# Altium schematic sheet FPGA_Power.SchDoc: =ProjectName
size 420 x 297 mm; Author: T.P.; CompanyName: WUT; DrawnBy: T.P.; Organization: WUT ISE; Address1: Warsaw Univeristy of Technology; Address2: Nowowiejska 15/19; DocumentNumber: 11; Revision: 0.9; SheetNumber: 11; SheetTotal: 36; EDA_Number: ARTIQ; Projet: ARTIQ/SINARA; ModifiedBy: -; CreateDate: XX/XX/XXXX; CheckedDate: -; Title2: FPGA_Power.SchDoc; DivGrp: ISE; Designer: G.K. and T.P.; ModifiedDate: -; ProjectName: ADC/DAC MEZZANINE
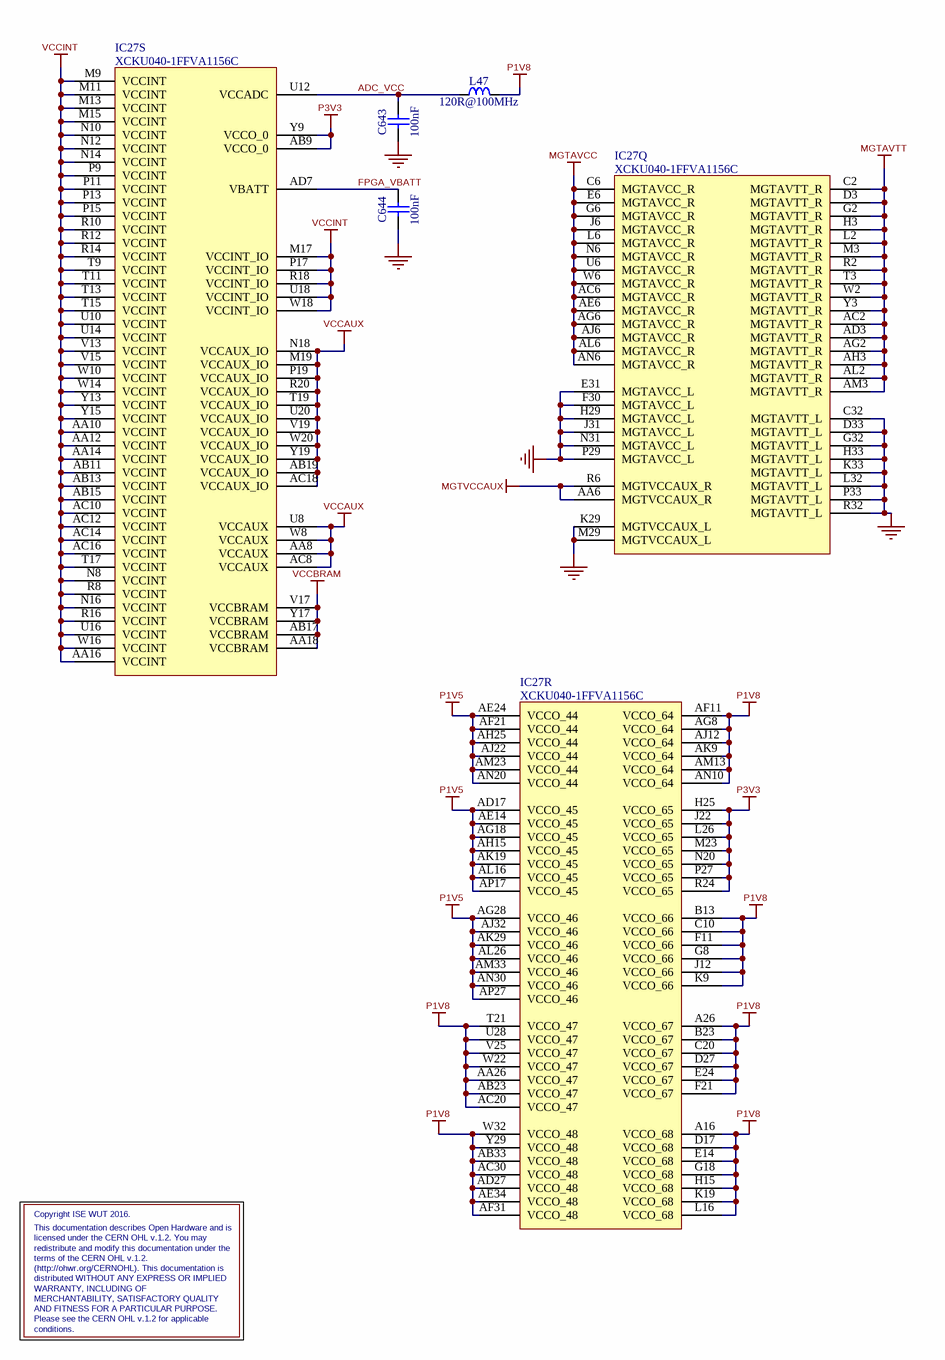
[diagram p0: FPGA_Power.SchDoc]

## Parts
C643  100nF  [CAPC0603X33N]
C644  100nF  [CAPC0603X33N]
IC27  XCKU040-1FFVA1156C  [BGA1156C100P34X34_3500X3500X350]  (parts Q,R,S of 22)
L47  120R@100MHz  [INDC1005X55N]

## Nets
GND: C643.1 C644.1 IC27.C32(MGTAVTT_L) IC27.D33(MGTAVTT_L) IC27.E31(MGTAVCC_L) IC27.F30(MGTAVCC_L) IC27.G32(MGTAVTT_L) IC27.H29(MGTAVCC_L) IC27.H33(MGTAVTT_L) IC27.J31(MGTAVCC_L) IC27.K29(MGTVCCAUX_L) IC27.K33(MGTAVTT_L) IC27.L32(MGTAVTT_L) IC27.M29(MGTVCCAUX_L) IC27.N31(MGTAVCC_L) IC27.P29(MGTAVCC_L) IC27.P33(MGTAVTT_L) IC27.R32(MGTAVTT_L)
MGTAVCC: IC27.AC6(MGTAVCC_R) IC27.AE6(MGTAVCC_R) IC27.AG6(MGTAVCC_R) IC27.AJ6(MGTAVCC_R) IC27.AL6(MGTAVCC_R) IC27.AN6(MGTAVCC_R) IC27.C6(MGTAVCC_R) IC27.E6(MGTAVCC_R) IC27.G6(MGTAVCC_R) IC27.J6(MGTAVCC_R) IC27.L6(MGTAVCC_R) IC27.N6(MGTAVCC_R) IC27.U6(MGTAVCC_R) IC27.W6(MGTAVCC_R)
MGTAVTT: IC27.AC2(MGTAVTT_R) IC27.AD3(MGTAVTT_R) IC27.AG2(MGTAVTT_R) IC27.AH3(MGTAVTT_R) IC27.AL2(MGTAVTT_R) IC27.AM3(MGTAVTT_R) IC27.C2(MGTAVTT_R) IC27.D3(MGTAVTT_R) IC27.G2(MGTAVTT_R) IC27.H3(MGTAVTT_R) IC27.L2(MGTAVTT_R) IC27.M3(MGTAVTT_R) IC27.R2(MGTAVTT_R) IC27.T3(MGTAVTT_R) IC27.W2(MGTAVTT_R) IC27.Y3(MGTAVTT_R)
MGTVCCAUX: IC27.AA6(MGTVCCAUX_R) IC27.R6(MGTVCCAUX_R)
P1V5: IC27.AD17(VCCO_45) IC27.AE14(VCCO_45) IC27.AE24(VCCO_44) IC27.AF21(VCCO_44) IC27.AG18(VCCO_45) IC27.AG28(VCCO_46) IC27.AH15(VCCO_45) IC27.AH25(VCCO_44) IC27.AJ22(VCCO_44) IC27.AJ32(VCCO_46) IC27.AK19(VCCO_45) IC27.AK29(VCCO_46) IC27.AL16(VCCO_45) IC27.AL26(VCCO_46) IC27.AM23(VCCO_44) IC27.AM33(VCCO_46) IC27.AN20(VCCO_44) IC27.AN30(VCCO_46) IC27.AP17(VCCO_45) IC27.AP27(VCCO_46)
P1V8: IC27.A16(VCCO_68) IC27.A26(VCCO_67) IC27.AA26(VCCO_47) IC27.AB23(VCCO_47) IC27.AB33(VCCO_48) IC27.AC20(VCCO_47) IC27.AC30(VCCO_48) IC27.AD27(VCCO_48) IC27.AE34(VCCO_48) IC27.AF11(VCCO_64) IC27.AF31(VCCO_48) IC27.AG8(VCCO_64) IC27.AJ12(VCCO_64) IC27.AK9(VCCO_64) IC27.AM13(VCCO_64) IC27.AN10(VCCO_64) IC27.B13(VCCO_66) IC27.B23(VCCO_67) IC27.C10(VCCO_66) IC27.C20(VCCO_67) IC27.D17(VCCO_68) IC27.D27(VCCO_67) IC27.E14(VCCO_68) IC27.E24(VCCO_67) IC27.F11(VCCO_66) IC27.F21(VCCO_67) IC27.G8(VCCO_66) IC27.G18(VCCO_68) IC27.H15(VCCO_68) IC27.J12(VCCO_66) IC27.K9(VCCO_66) IC27.K19(VCCO_68) IC27.L16(VCCO_68) IC27.T21(VCCO_47) IC27.U28(VCCO_47) IC27.V25(VCCO_47) IC27.W22(VCCO_47) IC27.W32(VCCO_48) IC27.Y29(VCCO_48) L47.2
P3V3: IC27.AB9(VCCO_0) IC27.H25(VCCO_65) IC27.J22(VCCO_65) IC27.L26(VCCO_65) IC27.M23(VCCO_65) IC27.N20(VCCO_65) IC27.P27(VCCO_65) IC27.R24(VCCO_65) IC27.Y9(VCCO_0)
VCCAUX: IC27.AA8(VCCAUX) IC27.AB19(VCCAUX_IO) IC27.AC8(VCCAUX) IC27.AC18(VCCAUX_IO) IC27.M19(VCCAUX_IO) IC27.N18(VCCAUX_IO) IC27.P19(VCCAUX_IO) IC27.R20(VCCAUX_IO) IC27.T19(VCCAUX_IO) IC27.U8(VCCAUX) IC27.U20(VCCAUX_IO) IC27.V19(VCCAUX_IO) IC27.W8(VCCAUX) IC27.W20(VCCAUX_IO) IC27.Y19(VCCAUX_IO)
VCCBRAM: IC27.AA18(VCCBRAM) IC27.AB17(VCCBRAM) IC27.V17(VCCBRAM) IC27.Y17(VCCBRAM)
VCCINT: IC27.AA10(VCCINT) IC27.AA12(VCCINT) IC27.AA14(VCCINT) IC27.AA16(VCCINT) IC27.AB11(VCCINT) IC27.AB13(VCCINT) IC27.AB15(VCCINT) IC27.AC10(VCCINT) IC27.AC12(VCCINT) IC27.AC14(VCCINT) IC27.AC16(VCCINT) IC27.M9(VCCINT) IC27.M11(VCCINT) IC27.M13(VCCINT) IC27.M15(VCCINT) IC27.M17(VCCINT_IO) IC27.N8(VCCINT) IC27.N10(VCCINT) IC27.N12(VCCINT) IC27.N14(VCCINT) IC27.N16(VCCINT) IC27.P9(VCCINT) IC27.P11(VCCINT) IC27.P13(VCCINT) IC27.P15(VCCINT) IC27.P17(VCCINT_IO) IC27.R8(VCCINT) IC27.R10(VCCINT) IC27.R12(VCCINT) IC27.R14(VCCINT) IC27.R16(VCCINT) IC27.R18(VCCINT_IO) IC27.T9(VCCINT) IC27.T11(VCCINT) IC27.T13(VCCINT) IC27.T15(VCCINT) IC27.T17(VCCINT) IC27.U10(VCCINT) IC27.U14(VCCINT) IC27.U16(VCCINT) IC27.U18(VCCINT_IO) IC27.V13(VCCINT) IC27.V15(VCCINT) IC27.W10(VCCINT) IC27.W14(VCCINT) IC27.W16(VCCINT) IC27.W18(VCCINT_IO) IC27.Y13(VCCINT) IC27.Y15(VCCINT)
ADC_VCC: C643.2 IC27.U12(VCCADC) L47.1
FPGA_VBATT: C644.2 IC27.AD7(VBATT)

## Notes on the sheet
- distributed WITHOUT ANY EXPRESS OR IMPLIED
- redistribute and modify this documentation under the
- licensed under the CERN OHL v.1.2. You may
- Copyright ISE WUT 2016.
- (http://ohwr.org/CERNOHL). This documentation is
- This documentation describes Open Hardware and is
- terms of the CERN OHL v.1.2.
- Please see the CERN OHL v.1.2 for applicable
- WARRANTY, INCLUDING OF
- conditions.
- MERCHANTABILITY, SATISFACTORY QUALITY
- AND FITNESS FOR A PARTICULAR PURPOSE.
- Project/Equipment
- Document
- Designer
- Drawn by
- Check.by
- File
- Last Mod.
- Print Date
- Sheet
- Size
- A3
- of
- Rev

## Library data of the parts
C643 C644 = CC0201_100NF_6.3V_10%_X5R: Non-polarised capacitor; Manufacturer: GENERIC; Part Description: SMD Multilayer Chip Ceramic Capacitor; Manufacturer1 Part Number: 02016D104KAT2A; Tolerance: ±10%; Voltage: 6.3V; TC: X5R; Manufacturer Part Number: CC0201_100NF_6.3V_10%_X5R; Part Number: CC0201_100NF_6.3V_10%_X5R; Value: 100nF; Component Kind: Standard; Component Type: Standard; Pin Count: 2; Status: Not Recommended; Case: 0201; Mounted: Yes; Socket: No; SMD: Yes; Sense: No; Manufacturer1 Example: AVX; Manufacturer1 ComponentHeight: 0.33mm; HelpURL: \\cern.ch\dfs\Applications\Altium\Datasheets\CC0201_X5R_AVX.pdf; Author: CERN DEM JLC; CreateDate: 03.12.2007; LatestRevisionDate: 03.12.2007
IC27 = XCKU040-1FFVA1156C: Kintex UltraScale FPGA, 520 I/O, 530K Cells, 1156-Ball BGA, Speed Grade 1, Commercial Grade; Manufacturer: XILINX; Part Description: Kintex UltraScale, 40 DLL I/O, 416 HP I/O, 104 HR I/O, 1156-Pin BGA, Speed Grade 1, Commercial Grade; PressFit: No; Bonding: No; Manufacturer Part Number: XCKU040-1FFVA1156C; PackageDescription: BGA, 1.00mm Pitch, Square; 1156 Pin, 34 Columns X 34 Rows, Body 35.00mm X 35.00mm X 3.50mm H, IPC Medium Density; Part Number: XCKU040-1FFVA1156C; Component Kind: Standard; Component Type: Standard; Device: XCKU040-1FFVA1156C; Pin Count: 1156; Case: BGA1156; Mounted: Yes; Socket: No; SMD: Yes; Sense: No; ComponentHeight: 3.5mm; HelpURL: \\cern.ch\dfs\Applications\Altium\Datasheets\XCKU040-1FFVA1156C.pdf; ComponentLink1URL: \\cern.ch\dfs\Applications\Altium\Datasheets\XCKU040-1FFVA1156C_Package-Pinout.pdf; ComponentLink1Description: Package/Pinout; Author: CERN DEM CA; CreateDate: 16.08.2016; LatestRevisionDate: 16.08.2016
L47 = IND0402_MURATA_BLM15PX121SN1D: Inductor; Manufacturer: MURATA; Part Description: SMD EMIFIL Chip Ferrite Bead; Tolerance: ±25%; Power: 2A; Resistance: 0.055R; Manufacturer Part Number: BLM15PX121SN1D; Part Number: IND0402_MURATA_BLM15PX121SN1D; Value: 120R@100MHz; Component Kind: Standard; Component Type: Standard; Pin Count: 2; Status: None; Case: 0402; Mounted: Yes; Socket: No; SMD: Yes; Sense: No; ComponentHeight: 0.55mm; HelpURL: \\cern.ch\dfs\Applications\Altium\Datasheets\IND0402_MURATA_BLM15PX.pdf; Author: CERN DEM JMW; CreateDate: 19.02.2014; LatestRevisionDate: 19.02.2014